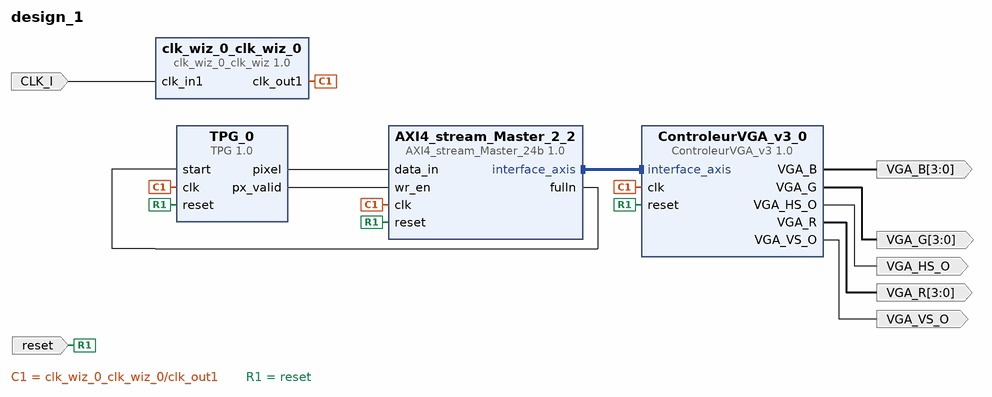
[diagram p0: block diagram of the top level]
# Vivado block design design_1, xc7z007sclg400-1, Vivado 2020.2
create_bd_design design_1

create_bd_port -dir O -from 3 -to 0 VGA_R
create_bd_port -dir O -from 3 -to 0 VGA_B
create_bd_port -dir O VGA_HS_O
create_bd_port -dir O VGA_VS_O
create_bd_port -dir O -from 3 -to 0 VGA_G
create_bd_port -dir I -type rst reset
set_property -dict {CONFIG.POLARITY ACTIVE_HIGH} [get_bd_ports reset]
create_bd_port -dir I -type clk CLK_I
set_property -dict {CONFIG.FREQ_HZ 125000000} [get_bd_ports CLK_I]

create_bd_cell -type ip -vlnv user.org:user:clk_wiz_0_clk_wiz:1.0 clk_wiz_0_clk_wiz_0
create_bd_cell -type ip -vlnv user.org:user:AXI4_stream_Master_24b:1.0 AXI4_stream_Master_2_2
create_bd_cell -type ip -vlnv user.org:user:ControleurVGA_v3:1.0 ControleurVGA_v3_0
create_bd_cell -type ip -vlnv user.org:user:TPG:1.0 TPG_0

# ---- connections ----

connect_bd_intf_net [get_bd_intf_pins AXI4_stream_Master_2_2/interface_axis] [get_bd_intf_pins ControleurVGA_v3_0/interface_axis]
connect_bd_net [get_bd_ports CLK_I] [get_bd_pins clk_wiz_0_clk_wiz_0/clk_in1]
connect_bd_net [get_bd_pins clk_wiz_0_clk_wiz_0/clk_out1] \
  [get_bd_pins AXI4_stream_Master_2_2/clk] [get_bd_pins ControleurVGA_v3_0/clk] [get_bd_pins TPG_0/clk]
connect_bd_net [get_bd_ports reset] [get_bd_pins AXI4_stream_Master_2_2/reset] [get_bd_pins ControleurVGA_v3_0/reset] [get_bd_pins TPG_0/reset]
connect_bd_net [get_bd_pins TPG_0/pixel] [get_bd_pins AXI4_stream_Master_2_2/data_in]
connect_bd_net [get_bd_pins TPG_0/px_valid] [get_bd_pins AXI4_stream_Master_2_2/wr_en]
connect_bd_net [get_bd_pins ControleurVGA_v3_0/VGA_HS_O] [get_bd_ports VGA_HS_O]
connect_bd_net [get_bd_pins ControleurVGA_v3_0/VGA_VS_O] [get_bd_ports VGA_VS_O]
connect_bd_net [get_bd_pins ControleurVGA_v3_0/VGA_R] [get_bd_ports VGA_R]
connect_bd_net [get_bd_pins ControleurVGA_v3_0/VGA_G] [get_bd_ports VGA_G]
connect_bd_net [get_bd_pins ControleurVGA_v3_0/VGA_B] [get_bd_ports VGA_B]
connect_bd_net [get_bd_pins AXI4_stream_Master_2_2/fulln] [get_bd_pins TPG_0/start]

validate_bd_design
save_bd_design
